# EAGLE board Zegar (EAGLE 5.06), part 1 of 2
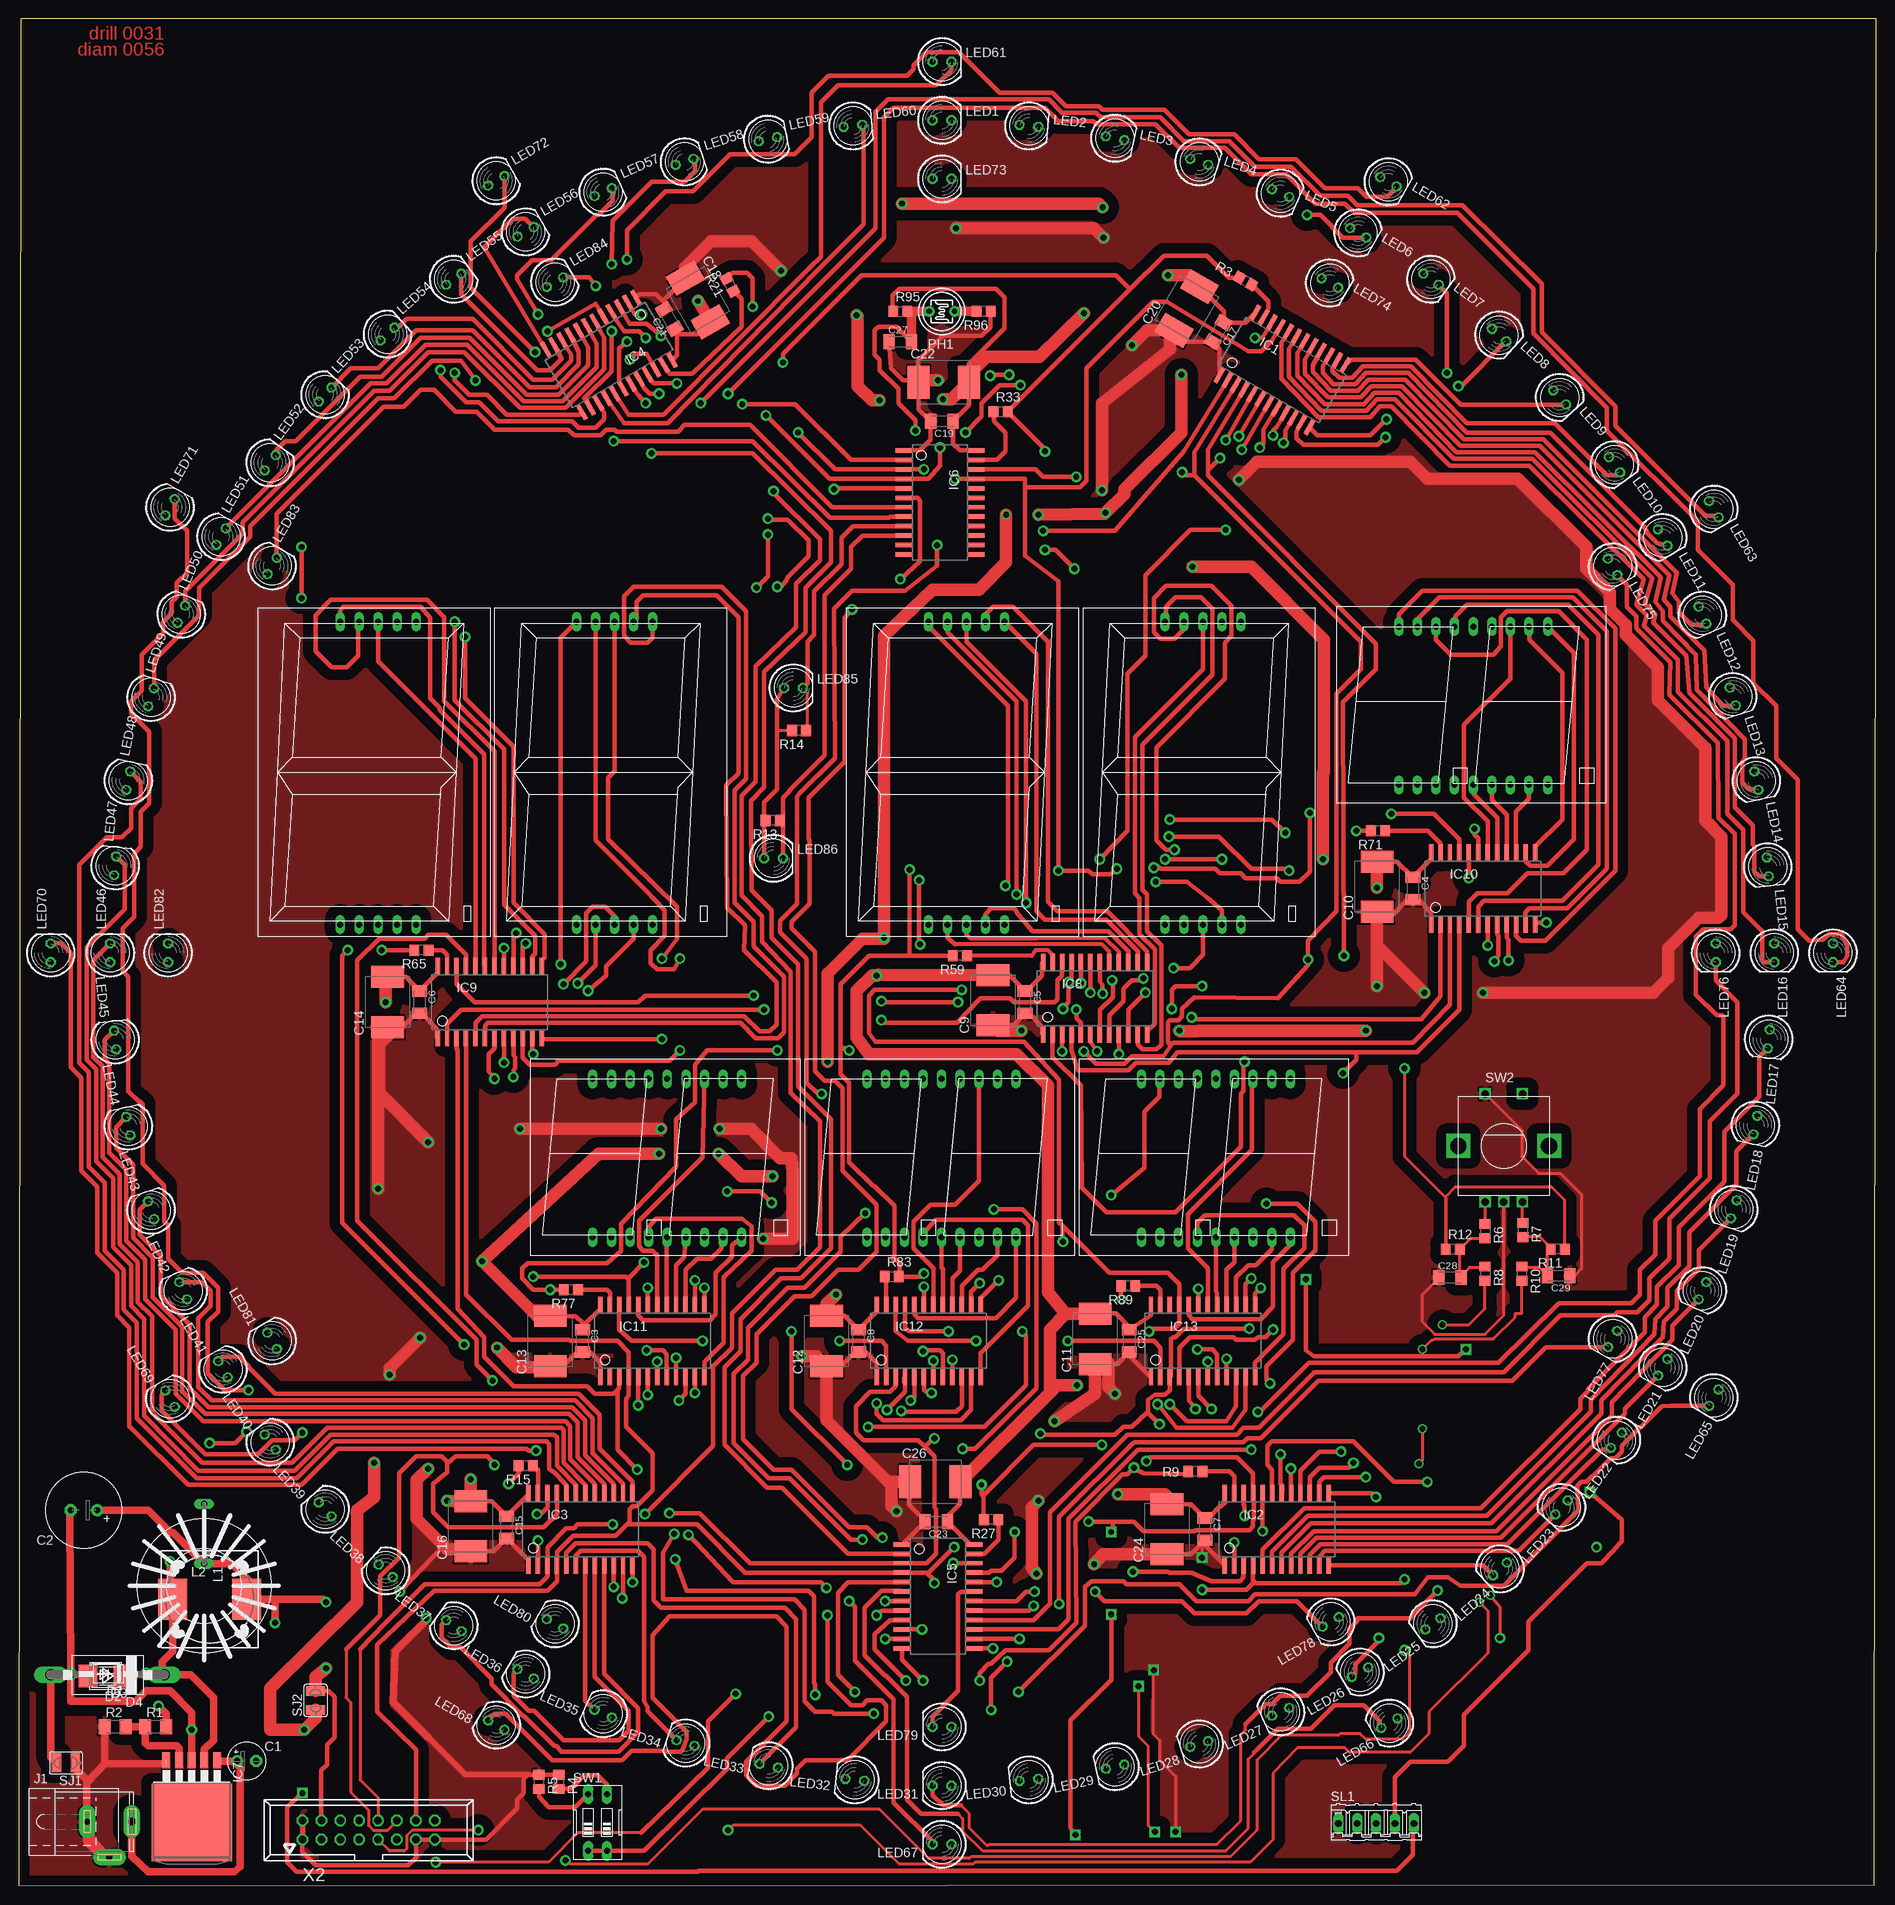
[diagram p2: board, top side]
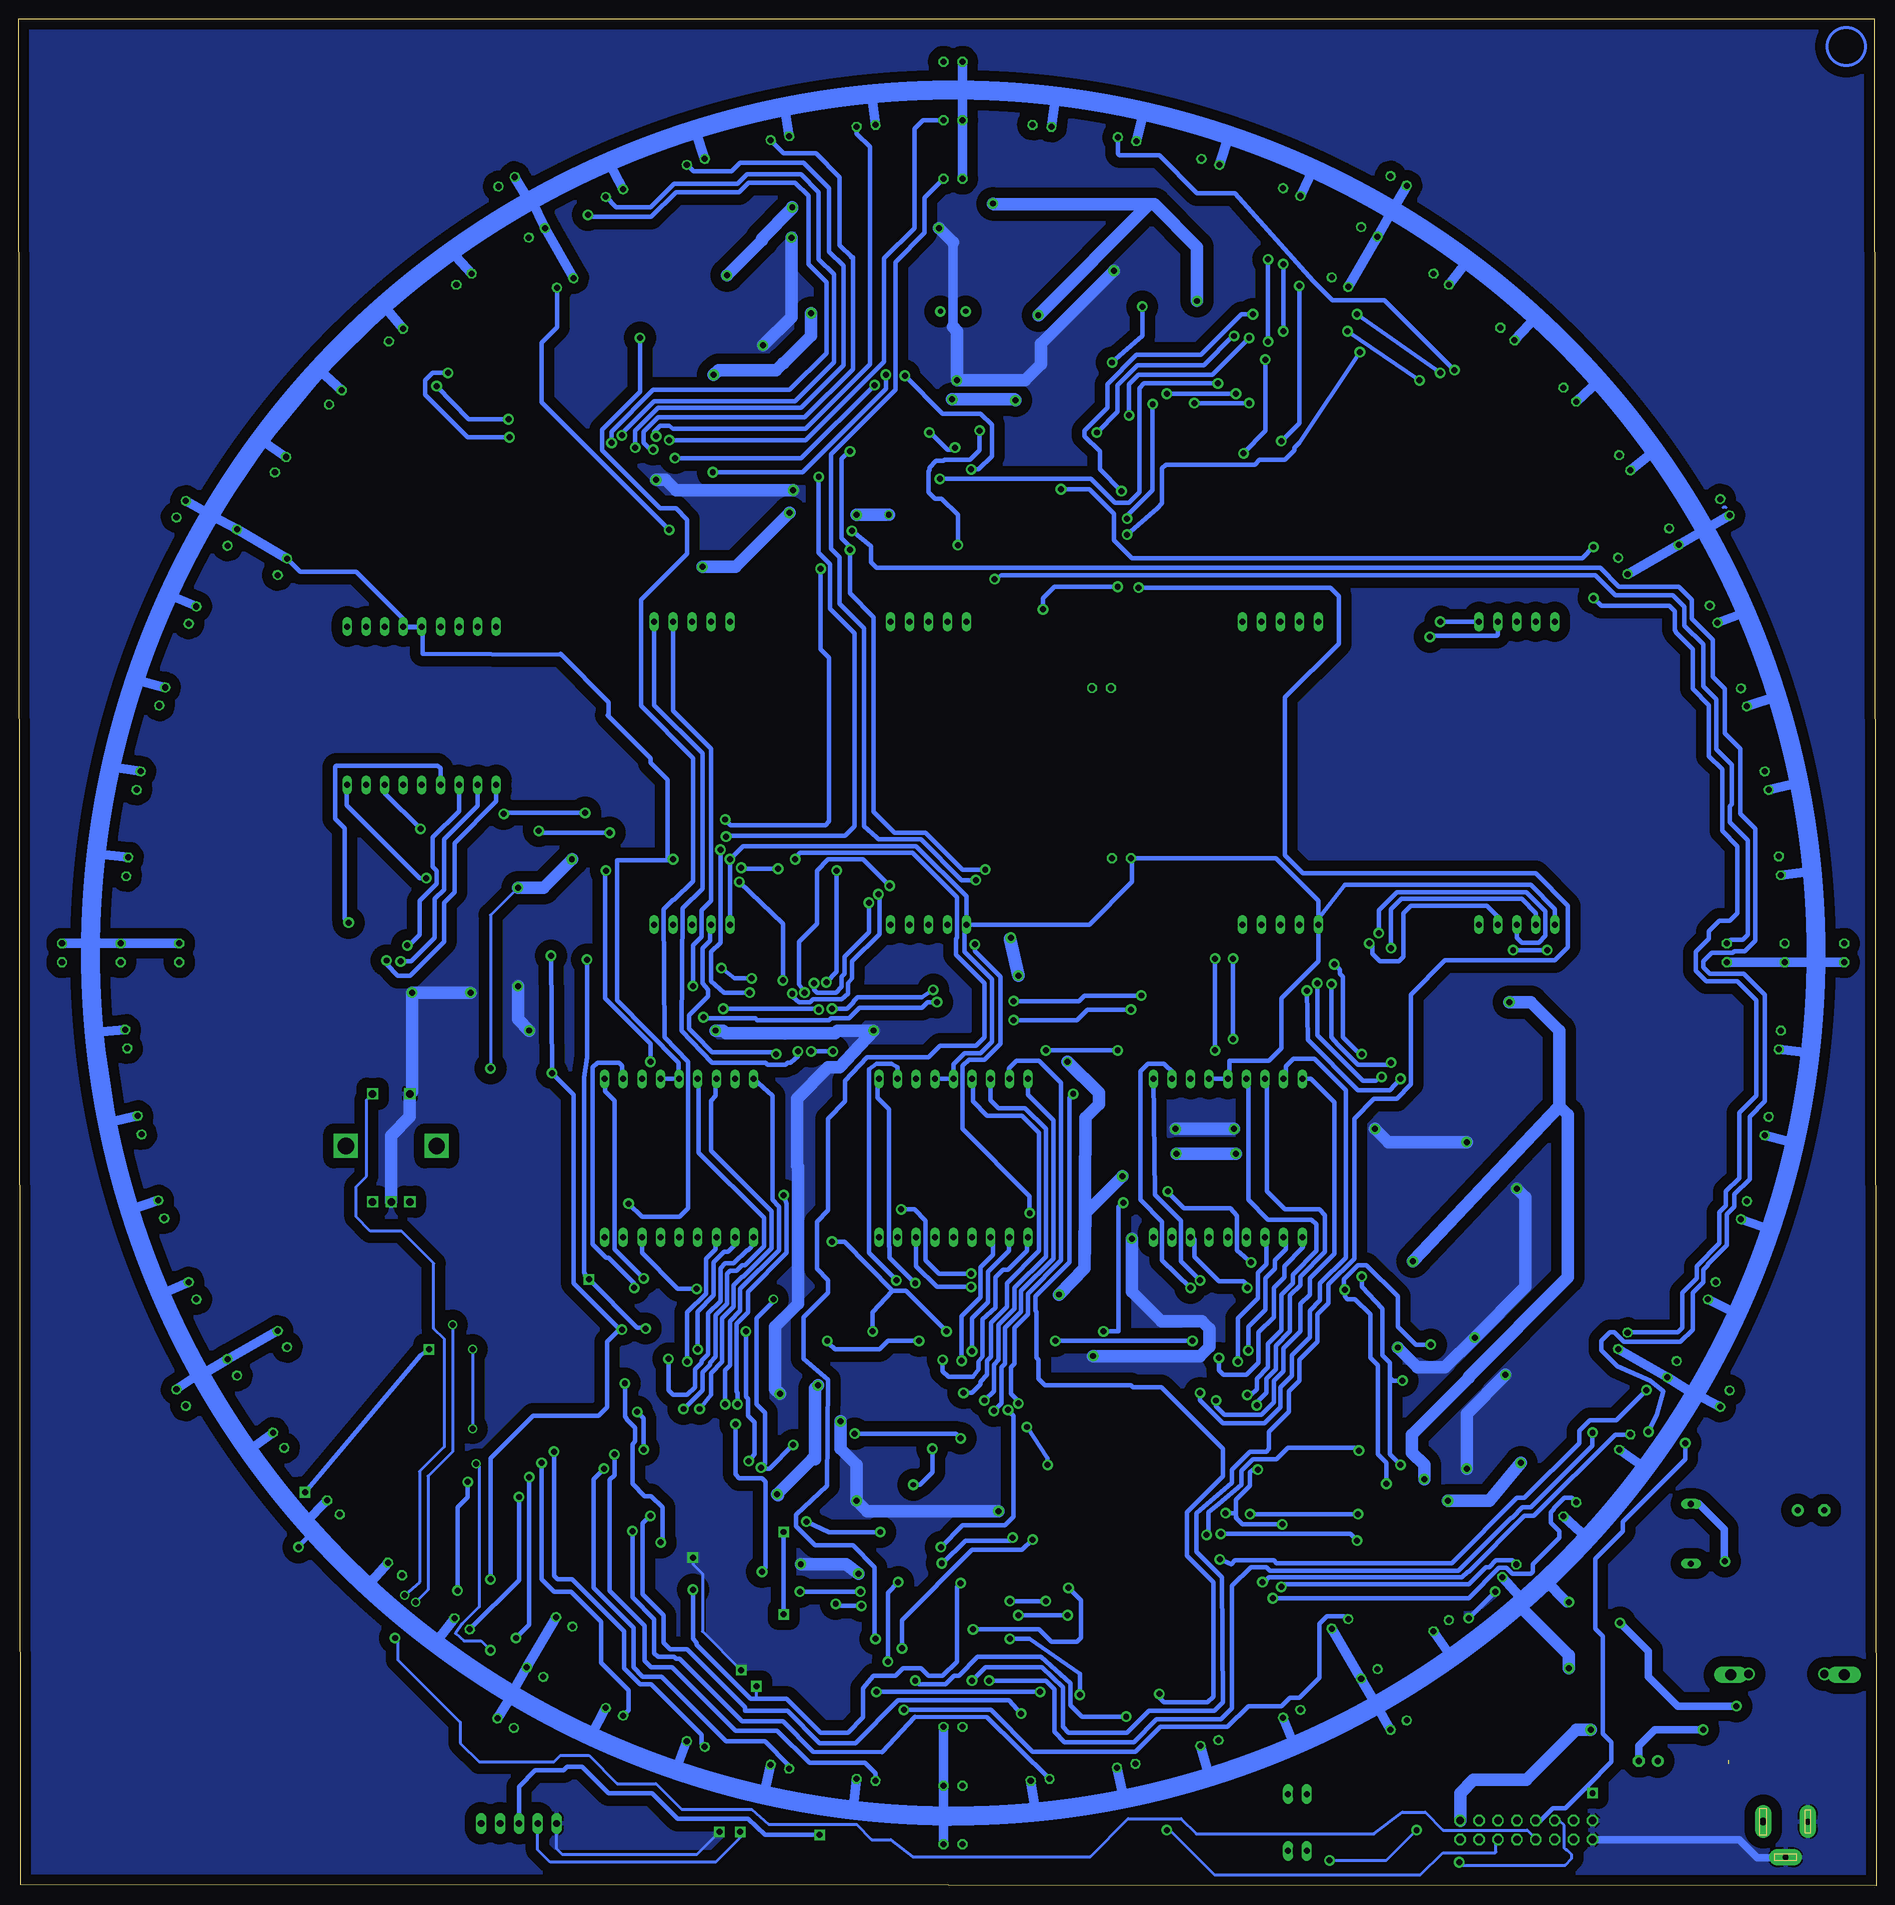
[diagram p3: board, bottom side, seen from below]

Size 249.41 x 250.62 mm. Coordinates in mm from the lower left corner, seen from the top.
Outline: 0,0 249.15,0.13 249.41,250.62 0.25,250.62 0,0
Copper layers (1*16): Top 0.035mm / dielectric 1.5mm / Bottom 0.035mm
Design rules "default": minimum track width 10mil, minimum drill 24mil, track to track 8mil, track to pad 8mil, pad to pad 8mil, via to via 8mil, smd to smd 8mil, copper to edge 40mil, drill to drill 8mil, minimum pad ring 10mil, minimum via ring 8mil, stop-mask expansion 4mil, vias tented up to drill 0mil, thermal gap 10mil

## Footprints (pad centres in the part's own frame; a part is rotated, then mirrored left to right if it is on the bottom)
E2,5-5 = drill 0.813 pad 1.6 round: + -1.27,0 | drill 0.813 pad 1.6 octagon: - 1.27,0
E3,5-10 = drill 0.813 pad 1.6 round: + -1.778,0 | drill 0.813 pad 1.6 octagon: - 1.778,0
C1206K = smd 1.5 x 2: 1 -1.5,0; 2 1.5,0
E/7260-38W = smd 2.95 x 4.4: + 3.375,0; - -3.375,0
DO41-10 = drill 1.118 round: A 5.08,0; C -5.08,0
SMB = smd 2.159 x 2.743: 1 -2.311,-0.127; 2 2.108,-0.102
MELF-MLL41 = smd 2.5 x 3: A 2.625,0; C -2.625,0
C2673 = drill 1.499 long: A 7.62,0; C -7.62,0
DISPLEDMALYPODW = drill 0.8 long: 1A 13.75,25; 1B 16.25,25; 1C 13.75,3.75; 1D 11.25,3.75; 1DP 16.25,3.75; 1E 8.75,3.75; 1F 8.75,25; 1G 11.25,25; 2A 26.25,25; 2B 28.75,25; 2C 26.25,3.75; 2D 21.25,3.75; 2DP 28.75,3.75; 2E 18.75,3.75; 2F 23.75,25; 2G 23.75,3.75; AN1 18.75,25; AN2 21.25,25
DISPLEDDUZYPOL = drill 0.8 long: A 19.05,43.18; AN 11.43,2.54; AN1 21.59,2.54; B 21.59,43.18; C 19.05,2.54; D 16.51,2.54; DP 16.51,43.18; E 13.97,2.54; F 13.97,43.18; G 11.43,43.18
SSOP24 = smd 0.6 x 2.2: 1 -6.985,-4.854; 2 -5.715,-4.854; 3 -4.445,-4.854; 4 -3.175,-4.854; 5 -1.905,-4.854; 6 -0.635,-4.854; 7 0.635,-4.854; 8 1.905,-4.854; 9 3.175,-4.854; 10 4.445,-4.854; 11 5.715,-4.854; 12 6.985,-4.854; 13 6.985,4.854; 14 5.715,4.854; 15 4.445,4.854; 16 3.175,4.854; 17 1.905,4.854; 18 0.635,4.854; 19 -0.635,4.854; 20 -1.905,4.854; 21 -3.175,4.854; 22 -4.445,4.854; 23 -5.715,4.854; 24 -6.985,4.854
TO263-5 = smd 1.067 x 2.159: 1 -3.404,-5.791; 2 -1.702,-5.791; 3 0,-5.791; 4 1.702,-5.791; 5 3.404,-5.791 | smd 10.8 x 10.41: 6 0,2.54
SPC4077 = drill 0.8 pad 2.184 long: 1 -3,0; 2 0,-4.8 | drill 1 pad 2.184 long: 3 3,0
10-17 = drill 0.813 long: 1 -11,0; 2 -3,0
DR125 = smd 3.85 x 5.5: 1 -4.975,0; 2 4.975,0
LED5MM = drill 0.813 octagon: A -1.27,0; K 1.27,0
T0-46-A10XX = drill 0.7 pad 1.4 round: 1 -1.7,0; 2 1.7,0
M1206 = smd 1.6 x 2: 1 -1.4,0; 2 1.4,0
R0805 = smd 1.3 x 1.5: 1 -0.95,0; 2 0.95,0
SJW = smd 1.27 x 2.54: 1 -1.27,0; 2 1.27,0
05P = drill 0.914 long: 1 -5.08,0; 2 -2.54,0; 3 0,0; 4 2.54,0; 5 5.08,0
EDG-02 = drill 0.813 long: 1 -1.27,-3.81; 2 1.27,-3.81; 3 1.27,3.81; 4 -1.27,3.81
ALPS_EC12E_SW = drill 1 square: A -2.5,-7.5; B 2.5,-7.5; C 0,-7.5; D -2.5,7; E 2.5,7 | drill 2.2 square: GND1 -6.1,0; GND2 6.1,0
057-016-1 = drill 1 octagon: 1 -8.89,-1.27; 2 -8.89,1.27; 3 -6.35,-1.27; 4 -6.35,1.27; 5 -3.81,-1.27; 6 -3.81,1.27; 7 -1.27,-1.27; 8 -1.27,1.27; 9 1.27,-1.27; 10 1.27,1.27; 11 3.81,-1.27; 12 3.81,1.27; 13 6.35,-1.27; 14 6.35,1.27; 15 8.89,-1.27; 16 8.89,1.27

## Placement (x,y rotation side)
C1  470uF  [E2,5-5]  30.61,16.76 0 top
C2  220uF  [E3,5-10]  8.76,50.42 180 top
C3  [C1206K]  75.69,73.15 270 top
C4  [C1206K]  187.2,133.86 270 top
C5  [C1206K]  135.13,118.62 270 top
C6  [C1206K]  53.85,118.62 270 top
C7  [C1206K]  159.26,47.88 270 top
C8  [C1206K]  112.78,73.15 270 top
C9  [E/7260-38W]  130.81,118.87 90 top
C10  [E/7260-38W]  182.37,134.11 90 top
C11  [E/7260-38W]  144.53,73.41 90 top
C12  [E/7260-38W]  108.46,73.15 90 top
C13  [E/7260-38W]  71.37,73.15 90 top
C14  [E/7260-38W]  49.53,118.62 90 top
C15  [C1206K]  65.53,48.13 270 top
C16  [E/7260-38W]  60.71,48.26 90 top
C17  [C1206K]  161.04,208.53 240 top
C18  [E/7260-38W]  91.19,212.85 300 top
C19  [C1206K]  123.95,196.6 180 top
C20  [E/7260-38W]  156.84,211.71 60 top
C21  [C1206K]  87.38,210.31 120 top
C22  [E/7260-38W]  124.21,201.8 0 top
C23  [C1206K]  123.19,48.89 180 top
C24  [E/7260-38W]  154.18,47.88 90 top
C25  [C1206K]  149.1,73.15 270 top
C26  [E/7260-38W]  123.06,54.23 0 top
C27  10n  [C1206K]  118.36,207.26 0 top
C28  10nf  [C1206K]  192.15,81.66 0 top
C29  10nf  [C1206K]  206.76,81.92 180 top
D1  1N4942  [DO41-10]  12.06,28.45 180 top
D2  [SMB]  11.56,28.07 180 top
D3  [MELF-MLL41]  11.94,28.19 180 top
D4  [C2673]  11.94,28.32 180 top
DL_S1  DISPL_LED_MALY_PODW_JJ  [DISPLEDMALYPODW]  176.53,144.02 0 top
DL_S2  DISPL_LED_MALY_PODW_JJ  [DISPLEDMALYPODW]  68.33,83.31 0 top
DL_S3  DISPL_LED_MALY_PODW_JJ  [DISPLEDMALYPODW]  105.16,83.31 0 top
DL_S4  DISPL_LED_MALY_PODW_JJ  [DISPLEDMALYPODW]  141.99,83.31 0 top
DUZY_JJ1  DISP-LED-DUZY-POL_JJ  [DISPLEDDUZYPOL]  142.49,126.49 0 top
DUZY_JJ2  DISP-LED-DUZY-POL_JJ  [DISPLEDDUZYPOL]  110.74,126.49 0 top
DUZY_JJ3  DISP-LED-DUZY-POL_JJ  [DISPLEDDUZYPOL]  63.5,126.49 0 top
DUZY_JJ4  DISP-LED-DUZY-POL_JJ  [DISPLEDDUZYPOL]  31.75,126.49 0 top
IC1  SCT 2024  [SSOP24]  169.67,203.45 330 top
IC2  SCT 2024  [SSOP24]  168.91,47.88 0 top
IC3  SCT 2024  [SSOP24]  75.44,47.88 0 top
IC4  SCT 2024  [SSOP24]  79.25,205.49 210 top
IC5  SCT 2024  [SSOP24]  123.44,38.86 270 top
IC6  SCT 2024  [SSOP24]  123.7,185.67 270 top
IC7  LM2576S lub 2596  [TO263-5]  23.24,11.05 180 top
IC8  SCT 2024  [SSOP24]  144.53,119.13 0 top
IC9  SCT 2024  [SSOP24]  63.25,118.62 0 top
IC10  SCT 2024  [SSOP24]  196.6,133.86 0 top
IC11  SCT 2024  [SSOP24]  85.09,73.15 0 top
IC12  SCT 2024  [SSOP24]  122.17,73.15 0 top
IC13  SCT 2024  [SSOP24]  159,73.15 0 top
J1  [SPC4077]  12.19,8.64 0 top
L1  [10-17]  24.89,40.26 270 top
L2  DR125  [DR125]  25.65,38.48 0 top
LED1  [LED5MM]  123.95,236.98 0 top
LED2  [LED5MM]  135.64,236.22 354 top
LED3  [LED5MM]  147.19,234.57 348 top
LED4  [LED5MM]  158.5,231.39 342 top
LED5  [LED5MM]  169.42,227.2 336 top
LED6  [LED5MM]  179.83,221.87 330 top
LED7  [LED5MM]  189.61,215.65 324 top
LED8  [LED5MM]  198.75,208.15 318 top
LED9  [LED5MM]  206.88,199.77 312 top
LED10  [LED5MM]  214.25,190.75 306 top
LED11  [LED5MM]  220.73,180.97 300 top
LED12  [LED5MM]  226.06,170.56 294 top
LED13  [LED5MM]  230.12,159.64 288 top
LED14  [LED5MM]  233.3,148.34 282 top
LED15  [LED5MM]  234.82,136.78 276 top
LED16  [LED5MM]  235.71,125.22 270 top
LED17  [LED5MM]  234.95,113.67 264 top
LED18  [LED5MM]  233.17,102.11 258 top
LED19  [LED5MM]  230.25,90.81 252 top
LED20  [LED5MM]  226.06,79.88 246 top
LED21  [LED5MM]  220.73,69.6 240 top
LED22  [LED5MM]  214.5,59.82 234 top
LED23  [LED5MM]  207.14,50.8 228 top
LED24  [LED5MM]  198.88,42.54 222 top
LED25  [LED5MM]  189.86,35.18 216 top
LED26  [LED5MM]  180.09,28.7 210 top
LED27  [LED5MM]  169.42,23.37 204 top
LED28  [LED5MM]  158.5,19.05 198 top
LED29  [LED5MM]  147.19,16 192 top
LED30  [LED5MM]  135.64,14.22 186 top
LED31  [LED5MM]  123.95,13.46 180 top
LED32  [LED5MM]  112.27,14.22 174 top
LED33  [LED5MM]  100.71,16.13 168 top
LED34  [LED5MM]  89.54,19.18 162 top
LED35  [LED5MM]  78.49,23.11 156 top
LED36  [LED5MM]  68.07,28.45 150 top
LED37  [LED5MM]  58.42,34.92 144 top
LED38  [LED5MM]  49.28,42.29 138 top
LED39  [LED5MM]  41.15,50.55 132 top
LED40  [LED5MM]  33.78,59.56 126 top
LED41  [LED5MM]  27.43,69.34 120 top
LED42  [LED5MM]  22.1,79.88 114 top
LED43  [LED5MM]  17.78,90.68 108 top
LED44  [LED5MM]  14.73,101.98 102 top
LED45  [LED5MM]  12.95,113.54 96 top
LED46  [LED5MM]  12.32,125.22 90 top
LED47  [LED5MM]  12.95,136.91 84 top
LED48  [LED5MM]  14.73,148.34 78 top
LED49  [LED5MM]  17.78,159.51 72 top
LED50  [LED5MM]  21.84,170.69 66 top
LED51  [LED5MM]  27.18,181.1 60 top
LED52  [LED5MM]  33.78,191.01 54 top
LED53  [LED5MM]  41.15,200.15 48 top
LED54  [LED5MM]  49.53,208.28 42 top
LED55  [LED5MM]  58.42,215.65 36 top
LED56  [LED5MM]  68.07,222 30 top
LED57  [LED5MM]  78.49,227.33 24 top
LED58  [LED5MM]  89.41,231.39 18 top
LED59  [LED5MM]  100.58,234.44 12 top
LED60  [LED5MM]  112.01,236.22 6 top
LED61  [LED5MM]  123.95,244.86 0 top
LED62  [LED5MM]  183.9,228.73 330 top
LED63  [LED5MM]  227.58,184.78 300 top
LED64  [LED5MM]  243.59,125.22 270 top
LED65  [LED5MM]  227.58,65.53 240 top
LED66  [LED5MM]  184.02,21.84 210 top
LED67  [LED5MM]  123.95,5.59 180 top
LED68  [LED5MM]  64.14,21.59 150 top
LED69  [LED5MM]  20.32,65.41 120 top
LED70  [LED5MM]  4.32,125.22 90 top
LED71  [LED5MM]  20.32,185.04 60 top
LED72  [LED5MM]  64.14,228.85 30 top
LED73  [LED5MM]  123.95,229.11 0 top
LED74  [LED5MM]  176.02,215.14 330 top
LED75  [LED5MM]  214,177.04 300 top
LED76  [LED5MM]  227.84,125.22 270 top
LED77  [LED5MM]  214,73.41 240 top
LED78  [LED5MM]  176.15,35.43 210 top
LED79  [LED5MM]  123.95,21.34 180 top
LED80  [LED5MM]  72.01,35.18 150 top
LED81  [LED5MM]  34.04,73.15 120 top
LED82  [LED5MM]  20.07,125.22 90 top
LED83  [LED5MM]  34.04,177.16 60 top
LED84  [LED5MM]  72.01,215.26 30 top
LED85  [LED5MM]  104.01,160.78 0 top
LED86  [LED5MM]  101.35,137.92 0 top
PH1  A1050_11  [T0-46-A10XX]  123.95,211.33 0 top
R1  [M1206]  18.42,21.34 0 top
R2  [M1206]  12.95,21.34 0 top
R3  1k  [R0805]  164.72,215.39 150 top
R4  [R0805]  72.52,13.97 270 top
R5  [R0805]  69.85,13.97 270 top
R6  200ohm  [R0805]  196.85,87.88 270 top
R7  200ohm  [R0805]  201.93,88.01 270 top
R8  200ohm  [R0805]  196.85,82.17 270 top
R9  1k  [R0805]  157.99,55.63 180 top
R10  200ohm  [R0805]  201.8,82.17 270 top
R11  10k  [R0805]  206.63,85.47 180 top
R12  10k  [R0805]  192.53,85.47 0 top
R13  na  [R0805]  101.22,143 180 top
R14  na  [R0805]  104.78,155.07 180 top
R15  1k  [R0805]  68.07,56.39 180 top
R21  1k  [R0805]  95.5,214.88 120 top
R27  1k  [R0805]  130.56,49.15 180 top
R33  1k  [R0805]  131.83,197.87 0 top
R59  1k  [R0805]  126.37,124.84 180 top
R65  1k  [R0805]  54.1,125.6 180 top
R71  1k  [R0805]  182.5,141.6 180 top
R77  1k  [R0805]  74.17,80.01 180 top
R83  1k  [R0805]  117.22,81.79 0 top
R89  1k  [R0805]  148.97,80.52 180 top
R95  10k  [R0805]  118.36,211.33 0 top
R96  10k  [R0805]  129.54,211.33 180 top
SJ1  [SJW]  6.35,16.51 180 top
SJ2  [SJW]  39.88,24.89 90 top
SL1  [05P]  182.25,8.38 0 top
SW1  [EDG-02]  77.72,8.51 0 top
SW2  EC12E_SW  [ALPS_EC12E_SW]  199.39,99.31 0 top
X2  057-016-1  [057-016-1]  46.99,7.49 0 top

## Tracks (layer width: path | path; a pad name or v marks a point on that pad's centre or on a via)
+5V  (via drill 0.8, 0.8 pad 1.42)
  Top 0.406: R11.1 207.52,85.53 207.52,92.08 205.74,93.85 192.91,93.85 191.58,92.52 R12.1 191.58,92.39 186.05,97.92 v186.05,109.73
  Top 0.61: C9.+ 133,122.25 C5.1 135.36,120.12 137.41,122.17 137.41,123.85 IC8.24 | C10.+ 185.07,137.49 C4.1 189.61,137.77 IC10.24 | C14.+ 51.97,121.99 C6.1 56.26,122.53 IC9.24 | IC4.24 88.39,205.44 88.39,208.28 | 88.39,208.28 88.13,208.55 C21.1 | C18.+ 91.22,208.28 88.39,208.28 | R95.1 117.35,211.39 117.35,213.49 118.24,214.38 131.19,214.38 132.33,213.23 132.33,209.04 127.58,204.29 127.58,202.82 C22.+ 127.58,198.72 C19.1 125.45,193.57 126.37,192.66 IC6.24 | C20.+ 161.79,211.38 C17.1 164.73,209.83 IC1.24 | C13.+ 71.45,76.45 74.8,76.45 75.69,75.57 C3.1 76.07,75.03 76.07,75.44 78.11,77.47 IC11.24 | C12.+ 110.9,76.53 C8.1 115.19,77.07 IC12.24 | IC13.24 152.02,76.58 150.75,75.69 149.25,74.8 C25.1 149.1,75.06 147.32,76.84 144.58,76.84 C11.+ | IC2.24 161.92,51.43 161.42,50.93 161.29,50.93 159.74,49.38 C7.1 157.38,51.25 C24.+ 154.18,52.27 | C26.+ 126.37,54.16 126.37,51.31 124.69,49.63 C23.1 127.74,45.85 IC5.24 | C16.+ 63.53,51.63 C15.1 68.45,52.55 IC3.24 | 145.8,184.15 v145.92,184.28
  Top 1.676: 138.43,66.22 C26.+ | 138.43,66.22 138.43,74.68 140.53,76.78 | 140.53,76.78 C11.+ | 140.53,76.78 138.18,79.65 138.18,107.44 133.98,111.63 114.17,111.63 112.52,113.92 112.52,120.14 114.63,122.25 115.12,122.25 v115.19,122.17 115.26,122.25 115.39,122.25 115.44,122.3 C9.+ | C13.+ 69.52,76.53 v62.23,83.82 77.85,98.3 v85.98,98.3 | v49.28,118.62 49.28,121.74 C14.+ | 154.18,52.27 153.87,52.58 v147.57,52.58 | C20.+ 157.01,216.15 v154.3,216.15 | v145.54,225.3 145.03,225.81 v118.62,225.81 | v91.19,212.72 C18.+ | v112.52,210.82 112.65,210.69 112.65,201.29 114.55,199.39 v115.57,199.39 | C22.+ 125.73,200.02 125.22,199.52 v124.08,199.52 | 138.43,66.22 139.39,67.18 v142.11,67.18 | v143,211.07 137.03,205.23 129.99,205.23 127.58,202.82 | v156.08,202.82 156.08,195.07 148.46,187.45 148.46,186.82 v145.92,184.28 | v157.61,177.04 165.48,177.04 175.26,167.26 175.26,149.48 175.13,149.35 v175.13,137.79 | v182.37,133.98 C10.+ | v132.59,184.02 132.59,177.67 128.91,173.99 122.68,173.99 116.2,167.77 v116.2,127.25 116.2,127.13 113.28,127.13 108.59,122.43 v108.59,110.62 | v136.91,184.02 145.8,184.15 | C12.+ 108.46,78.11 v109.73,79.38 | v101.22,95.25 97.03,95.25 v93.98,98.3 | v60.71,54.61 C16.+ 58.47,51.63 v57.53,51.69 | v47.75,56.77 47.75,52.2 45.47,50.42 45.47,38.1 33.78,26.54 33.78,20.96 v38.35,20.96 39.88,22.48 SJ2.1
  Bottom 0.406: v186.05,109.73 186.05,130.3 v182.37,133.98
  Bottom 0.61: 116.33,127.13 v116.2,127.25
  Bottom 1.676: v62.23,83.82 42.54,104.65 | 42.54,104.65 42.54,114.81 46.35,118.62 v49.28,118.62 | 147.45,52.45 v147.57,52.58 142.88,57.28 142.49,57.28 142.49,66.8 v142.11,67.18 | v154.3,216.15 149.61,220.85 149.61,221.11 145.54,225.17 v145.54,225.3 | v118.62,225.81 118.49,225.68 97.16,225.68 | 97.16,225.68 96.9,225.68 91.19,219.96 v91.19,212.72 | v115.57,199.39 115.7,199.52 v124.08,199.52 | v112.52,210.82 97.66,225.68 97.16,225.68 | v143,211.07 143,208.03 146.69,204.34 146.81,204.34 147.7,203.45 155.45,203.45 v156.08,202.82 | v145.92,184.28 153.16,177.04 v157.61,177.04 | v175.13,137.79 178.94,133.98 v182.37,133.98 | v115.19,122.17 116.33,127.13 | v132.59,184.02 v136.91,184.02 | 106.3,82.93 v109.73,79.38 | 106.3,82.93 106.17,103.12 104.39,104.9 104.39,106.43 v108.59,110.62 | 106.3,82.93 106.17,90.3 v101.22,95.25 | v93.98,98.3 v85.98,98.3 | v60.71,54.61 60.71,56.52 62.36,58.17 62.36,60.58 54.74,68.2 54.74,68.33 41.4,81.66 41.4,103.51 42.54,104.65 | v57.53,51.69 51.94,51.69 v47.75,56.77 | v38.35,20.96 40.26,20.96 46.99,14.22 54.1,14.22 55.88,12.45 X2.16
ADC_L  (via drill 0.8 pad 1.42)
  Top 0.406: 83.57,7.11 75.06,7.11 71.12,3.17 v56.01,3.17
  Top 0.61: C27.2 117.83,209.3 115.44,209.3 114.94,208.79 114.94,205.49 115.57,204.85 115.57,203.45 118.11,200.91 118.11,199.01 120.4,196.72 v120.4,195.33 | 123.19,180.09 v123.32,179.96 123.32,177.16 119,173.86 111.89,173.86 109.47,171.45 109.6,151.38 104.78,146.56 104.52,146.18 104.52,131.83 102.23,129.54 102.23,128.02 105.79,124.46 105.79,107.82 107.32,106.3 v107.82,106.3 | v96.27,25.78 92.58,22.1 92.58,15.88 83.57,7.11
  Top 1.27: 119.89,211.33 R95.2 | 119.89,211.33 PH1.1 | C27.2 119.89,208.53 119.89,211.33
  Bottom 0.406: v56.01,3.17 55.75,2.79 41.78,2.79 40.89,3.68 40.89,4.19 41.53,4.83 41.66,4.83 41.91,5.08 41.91,8.13 42.54,8.76 X2.6
  Bottom 0.61: v120.4,195.33 120.4,192.66 121.67,191.39 125.09,191.39 125.22,191.26 126.24,191.26 127.13,190.37 127.13,189.99 127.25,189.86 127.25,187.07 126.37,186.18 125.48,186.18 123.32,184.02 v123.32,179.96 | v107.82,106.3 108.33,105.79 108.33,83.69 112.9,79.12 112.9,77.22 112.78,77.09 112.78,70.87 112.52,70.61 112.52,68.07 111.63,67.18 100.08,67.18 99.82,66.93 96.01,66.93 87.76,58.67 87.76,54.99 92.58,50.16 92.58,44.32 89.03,40.77 89.03,25.4 89.79,24.64 95.63,24.64 96.27,25.27 v96.27,25.78
B$2
  Top 0.61: IC4.17 81.92,197.48 86.61,197.48 106.3,217.3 107.7,218.69 107.7,230.63 | 107.7,230.63 107.7,230.25 | 107.7,230.63 107.7,239.39 109.98,241.68 123.19,241.68 125.22,243.71 LED61.K
B$3  (via drill 0.8 pad 1.42)
  Top 0.61: IC4.18 80.65,201.8 80.65,206.38 v81.66,207.26 | v81.66,218.31 81.66,222.25 86.87,227.46 90.55,227.46 95.5,232.41 104.14,232.41 106.43,234.7 106.43,240.66 108.71,242.95 119.25,242.95 120.14,243.84 120.14,244.35 121.92,246.13 126.24,246.13 131.7,240.66 138.81,240.66 140.59,238.89 145.03,238.89 145.54,238.38 153.8,238.38 157.1,235.08 163.19,235.08 166.5,231.77 171.45,231.77 175.39,227.84 179.83,227.84 180.97,226.69 183.77,226.69 185,227.92 LED62.K
  Bottom 0.61: v81.66,207.26 v81.66,218.31
B$4  (via drill 0.8 pad 1.42)
  Top 0.61: LED63.K 228.01,183.9 226.44,183.9 214.38,195.96 214.38,198.63 204.47,208.53 204.47,215.01 193.8,225.55 179.7,225.55 178.44,226.82 174.75,226.82 170.81,230.76 165.99,230.76 162.56,234.19 156.46,234.19 153.29,237.36 145.29,237.36 144.65,238 140.08,238 138.3,239.78 116.71,239.78 115.06,238.12 115.06,222.5 v91.57,199.01 | v84.2,199.01 83.19,200.15 82.93,200.41 IC4.19
  Bottom 0.61: v84.2,199.01 v91.57,199.01
B$5  (via drill 0.8 pad 1.42)
  Top 0.61: IC4.20 83.95,201.04 84.71,200.28 v85.98,200.28 | v95.25,200.28 116.2,221.23 116.2,237.36 117.48,238.63 137.79,238.63 139.57,236.85 144.27,236.85 144.65,236.47 152.65,236.47 155.83,233.3 161.92,233.3 165.48,229.74 170.18,229.74 174.12,225.81 178.05,225.81 179.32,224.54 193.17,224.54 203.33,214.38 203.33,208.41 213.23,198.37 213.23,195.33 225.42,183.13 225.42,179.32 230.12,174.62 230.12,169.93 232.92,167.13 232.92,161.42 235.97,158.37 235.97,151.38 238.89,148.46 238.89,128.4 240.41,126.87 242.19,127 243.08,127.76 244.73,127.76 245.49,126.24 245.49,124.84 244.98,123.95 LED64.K 243.46,123.95
  Bottom 0.61: v85.98,200.28 v95.25,200.28
CLK  (via drill 0.8 pad 1.42)
  Top 0.406: X2.10 48.26,11.81 45.85,14.22 45.85,31.75
  Top 0.61: IC4.3 82.04,209.68 84.33,209.68 v86.23,208.03 | v104.65,195.07 109.6,190.12 IC6.3 v121.54,190.12 | IC10.3 192.15,118.24 187.2,113.16 154.94,113.16 154.62,112.71 | 154.62,112.71 153.67,111.38 149.48,111.38 148.46,110.36 144.65,110.36 v143,112.01 | v140.08,112.01 IC8.3 | IC1.3 157.86,192.41 157.86,189.36 | 157.86,189.36 180.21,167 180.21,163.32 176.91,160.02 176.91,130.81 173.1,126.87 v173.1,124.33 173.1,123.57 169.04,119.13 157.86,119.25 156.21,117.73 156.21,116.71 155.7,116.2 154.56,116.2 154.3,115.95 154.3,113.41 154.62,112.71 | v79.76,48.51 75.06,48.51 74.55,48.01 73.53,48.01 70.99,45.47 IC3.3 70.99,41.53 69.98,40.51 54.48,40.51 49.15,35.18 45.85,31.75 | v83.06,55.88 80.39,58.55 80.39,66.55 80.65,66.8 | v87.38,50.04 91.44,50.04 98.17,43.31 IC5.3 121.92,43.31 123.19,44.58 123.19,50.55 122.94,50.8 122.94,57.66 121.67,58.93 | 157.86,189.36 156.59,189.36 v156.21,189.74 | v132.97,202.82 130.56,202.82 v130.43,202.69 | 80.65,66.8 IC11.3 | 80.65,66.8 79.88,66.04 77.34,66.04 76.33,67.06 66.42,67.06 62.48,70.99 62.48,73.66 58.93,77.47 58.93,112.14 58.8,112.27 IC9.3 | IC12.3 117.73,67.06 116.97,66.29 114.3,66.29 | 114.3,66.29 112.4,64.39 112.4,60.83 113.41,59.82 120.78,59.82 121.67,58.93 | 114.3,66.29 113.67,65.66 | 151.64,63.63 151.64,65.28 152.53,65.91 153.92,65.91 154.56,66.55 IC13.3 154.69,68.43 154.69,73.41 154.94,73.66 155.32,73.66 156.46,74.8 v165.23,74.8 | 151.64,63.63 149.48,61.59 148.34,61.59 147.19,60.58 137.16,60.58 v137.16,60.71 | v122.94,60.07 122.81,60.07 121.67,58.93 | IC2.3 164.47,41.4 163.96,40.89 160.15,40.89 157.48,42.04 154.43,42.04 154.3,42.16 v149.61,42.16
  Top 0.61: v153.16,61.98 151.76,63.37 151.64,63.63 | SL1.4 184.78,14.61 186.82,16.64 191.9,16.64 194.06,18.8 194.06,22.99 202.69,31.62 202.69,35.43 210.57,43.31 212.47,43.31 214.25,45.09 214.25,45.21 215.26,46.23 215.26,49.15 212.72,51.31 v210.95,52.83 | v194.31,72.01 193.29,71.12 173.86,71.12 172.85,71.88 v172.85,81.41
  Bottom 0.61: v86.23,208.03 86.36,208.03 90.3,204.09 99.19,204.09 101.85,201.42 101.85,197.87 v104.65,195.07 | v143,112.01 v140.08,112.01 | v79.76,48.51 85.09,48.51 85.92,49.34 | 85.92,49.34 85.98,49.4 85.98,50.04 | 85.98,50.04 85.98,51.82 84.07,53.72 84.07,55.5 83.69,55.88 v83.06,55.88 | v87.38,50.04 85.98,50.04 | 85.98,50.04 85.92,49.34 | v156.21,189.74 144.14,189.74 132.97,200.91 v132.97,202.82 | v130.43,202.69 125.35,197.61 120.27,197.61 118.75,196.09 118.75,191.9 120.52,190.12 v121.54,190.12 | v137.16,60.71 123.57,60.71 v122.94,60.07 | v149.61,42.16 149.1,42.67 149.1,54.23 149.61,54.74 152.65,54.74 153.16,55.24 v153.16,61.98 | v165.23,74.8 165.35,74.93 166.37,74.93 v172.85,81.41 173.35,81.92 173.35,82.17 173.48,82.3 173.48,108.46 173.1,111.25 v173.1,124.33 | v210.95,52.83 195.45,71.25 v194.31,72.01
ENCA  (via drill 0.8, 0.8 pad 1.42)
  Top 0.406: v188.47,72.01 189.74,73.28 189.99,73.28 190.12,73.41 197.99,73.41 200.91,76.33 200.91,76.84 201.8,76.84 R10.2 | v188.47,61.34 188.47,57.15 v187.96,56.64 | v186.05,31.62 186.69,30.99 186.69,20.57 185.8,19.69 180.85,19.69 180.09,20.45 177.42,20.45 177.16,20.19 169.54,20.19 166.24,16.89 166.24,7.49 162.69,3.94 127.89,3.94 127.64,3.68 122.17,3.68 115.57,10.29 91.82,10.29 84.45,2.92 74.04,2.92 v73.41,3.43 | X2.9 49.78,4.7 51.82,4.7 52.07,4.95 52.07,6.73 52.83,7.49 v61.72,7.49
  Bottom 0.406: v188.47,72.01 v188.47,61.34 | v187.96,56.64 187.58,56.26 187.58,37.46 189.86,35.18 190.75,33.91 189.61,32.89 187.32,32.89 v186.05,31.62 | v61.72,7.49 65.79,3.43 72.9,3.43 | 72.9,3.43 73.03,3.43 | v73.41,3.43 72.9,3.43
ENCB  (via drill 0.8, 0.8 pad 1.42)
  Top 0.406: v196.09,38.1 197.23,36.96 197.23,31.24 189.36,23.37 189.36,20.45 186.82,17.91 178.69,17.91 178.05,18.54 171.7,18.54 168.4,15.11 168.4,6.22 165.35,3.17 128.4,3.17 128.14,2.92 118.24,2.92 113.03,8.13 95.89,8.13 v95.25,7.49 | v191.13,75.31 194.69,75.31 196.85,77.47 R8.2
  Bottom 0.406: v191.13,75.31 191.13,58.29 194.44,54.99 194.44,39.75 v196.09,38.1 | v95.25,7.49 94.87,7.49 88.9,1.52 61.21,1.52 58.17,4.45 51.18,4.45 51.05,4.57 51.05,5.97 X2.11
GND  (via drill 0.8 pad 1.42)  (1 unrouted)
  Top 0.406: IC4.1 82.44,213.61 | C29.1 208.91,81.92 209.8,82.8 209.8,92.84 207.01,95.63 204.09,95.63 201.8,97.92 201.8,101.4 SW2.D | C28.1 190.65,81.56 188.47,79.38 188.47,75.69 190.12,74.04 196.85,74.04 199.39,76.58 SW2.C | IC2.1 158.88,46.07 | 158.88,46.07 158.88,46.23 | 158.88,46.07 v158.88,44.07 | v152.4,28.96 152.27,28.83 152.27,20.45 153.16,19.56 153.16,16.89 155.32,14.73 v155.32,7.24
  Top 0.61: C9.- 133.76,115.62 C5.2 135.61,117.12 137.41,115.32 137.41,114.4 IC8.1 | C10.- 182.81,130.3 184.4,130.3 186.46,132.36 C4.2 187.22,132.33 187.96,132.33 189.61,130.68 IC10.1 | C14.- 51.49,115.24 53.34,117.09 53.82,117.09 C6.2 54.08,117.12 56.13,115.06 56.13,113.89 IC9.1 | IC11.1 78.11,70.23 76.71,71.63 75.72,71.63 C3.2 74.95,71.65 72.9,69.6 71.56,69.6 C13.- | IC4.1 83.3,213.61 85.6,213.61 86.63,212.59 C21.2 86.63,212.9 C18.- | C27.1 117.12,203.68 118.75,202.06 120.7,202.06 C22.- | R96.1 130.49,209.23 129.29,208.03 124.08,208.03 120.78,204.72 120.78,201.98 C22.- | C22.- 120.83,198.22 C19.2 122.45,194.08 121.03,192.66 IC6.1 | C20.- 156.71,207.23 C17.2 161.2,206.32 IC1.1 | C12.- 110.42,69.78 112.27,71.63 112.75,71.63 C8.2 113.77,71.65 115.19,70.23 IC12.1 | C11.- 147.48,70.03 C25.2 | C25.2 149.1,71.22 IC13.1 | C24.- 157.38,44.5 C7.2 159.26,45.69 IC2.1 | IC5.1 118.64,45.85 C23.2 121.69,49 119.51,51.18 119.51,54.05 C26.- | IC3.1 68.45,43.71 C15.2 63.78,44.88 C16.- 60.38,45.21 59.31,45.21 | C25.2 149.1,71.63 147.57,70.1 146.43,70.1 146.3,70.23 | v51.18,39.5 51.43,39.75 57.09,45.66 | 54.74,35.69 v54.74,35.94 | 37.85,6.1 38.23,6.48 38.23,8.89 X2.2 X2.1 38.1,4.57 39.88,2.79 52.32,2.79 53.34,3.81 X2.13 X2.15 62.74,6.22 66.93,10.41 66.93,11.56 67.82,12.45 67.82,14.35 68.39,14.92 R5.1 R4.1 | 54.99,19.94 55.12,19.94
  Top 0.813: 54.99,19.94 60.01,14.92 68.39,14.92
  Top 1.016: 13.08,16.38 11.56,16.38 9.33,14.03 | 13.08,16.38 19.81,16.38 | 9.33,14.03 9.14,13.84 9.14,8.68 J1.1 | SJ1.1 7.62,15.75 9.33,14.03 | R2.1 11.55,16.39 13.08,16.38 | 54.74,35.69 50.55,31.5 50.29,24.64 54.99,19.94
  Top 1.676: 117.22,54.23 C26.- | 117.22,54.23 116.71,54.23 108.46,62.48 C12.- 107.12,71.12 v105.16,71.12 | C11.- 144.53,66.04 v139.06,62.36 | C24.- 145.6,44.5 v144.4,43.18 | v136.65,41.91 136.02,42.67 136.02,50.8 v136.91,51.69 | C18.- 89.5,217.26 92.96,220.73 98.43,220.73 v102.36,216.79 | v123.44,202.06 120.96,202.06 C22.- | 154.56,208.79 151.51,208.79 v149.48,206.76 | 154.56,208.79 C20.- | v145.67,221.23 144.4,222.5 v125.86,222.5 | v117.86,50.29 117.22,50.93 117.22,54.23 | v145.41,187.32 145.41,199.01 154.56,206.25 154.56,208.79 | v163.83,188.72 166.24,191.13 186.82,191.13 189.1,188.85 201.29,188.85 210.44,179.7 210.44,176.78 213.61,173.61 213.61,171.45 215.77,169.29 215.77,167.89 220.09,163.58 220.09,159.13 226.44,152.78 226.44,143 228.6,140.84 228.6,130.3 228.22,129.92 225.55,129.92 221.49,125.86 221.49,121.92 219.46,119.89 v196.6,119.89 | v188.72,119.89 182.37,126.24 | 182.37,126.24 C10.- | 182.37,126.24 v182.37,120.78 | v180.85,114.81 158.37,114.81 158.24,114.68 155.96,114.68 v155.83,114.81 | v134.62,114.81 131.5,114.81 C9.- | 146.3,70.23 146.3,66.93 v147.19,66.04 | 71.56,69.6 66.8,69.6 v64.26,72.26 | v48.26,93.6 48.26,113.97 C14.- | 59.31,45.21 57.53,45.21 57.09,45.66 53.47,49.28 53.47,54.48 v54.99,56.01 | v49.78,68.58 49.78,69.47 v53.91,73.6 | 50.55,115.06 48.39,112.9 48.39,106.43 v54.99,99.82 | v86.23,101.6 v67.31,101.6 | v94.11,101.6 98.3,101.6 102.23,97.66 103.76,97.66 103.89,95.89 103.89,86.87 v99.95,86.87 | J1.2 11.66,3.84 9.4,6.1 9.4,8.43 J1.1
  Bottom 0.406: v158.88,44.07 158.88,43.18 157.61,41.91 157.61,34.16 v152.4,28.96 | v155.32,7.24 158.37,4.19 176.4,4.19 177.16,4.95 SL1.1
  Bottom 0.61: v196.6,119.89 197.1,119.89 | v54.74,35.94 v51.18,39.5
  Bottom 1.016: J1.2 12.22,3.81 16,3.81 18.42,6.22 X2.1
  Bottom 1.27: 123.95,220.6 123.95,209.3
  Bottom 1.676: v117.86,50.29 135.51,50.29 v136.91,51.69 136.91,56.52 139.06,58.67 v139.06,62.36 | v144.4,43.18 138.3,43.18 v136.65,41.91 | v102.36,216.79 112.14,207.01 112.14,204.22 114.3,202.06 v123.44,202.06 123.44,208.66 123.95,209.3 | v149.48,206.76 145.67,210.57 v145.67,221.23 | v125.86,222.5 123.95,220.6 | v145.41,187.32 161.16,187.32 162.56,188.72 v163.83,188.72 | v188.72,119.89 v196.6,119.89 196.6,106.61 SW2.D 196.89,103.21 199.39,100.71 SW2.C | v182.37,120.78 182.37,116.33 v180.85,114.81 | v155.83,114.81 154.81,114.81 154.43,114.43 139.83,114.43 139.45,114.81 v134.62,114.81 139.19,109.86 140.72,109.86 144.91,105.66 144.91,96.65 144.78,96.52 144.78,78.11 147.83,75.06 147.83,66.68 v147.19,66.04 | v64.26,72.26 61.59,69.6 57.91,69.6 v53.91,73.6 47.12,80.39 47.12,92.46 v48.26,93.6 | v54.99,56.01 54.99,63.37 v49.78,68.58 | v54.99,99.82 65.53,99.82 v67.31,101.6 | v94.11,101.6 v86.23,101.6 | v99.95,86.87 99.95,79.76 96.01,75.82 90.55,75.82 89.54,74.8 89.54,72.39 90.81,71.12 v105.16,71.12
  pour Bottom (isolate 1.422): -0.13,250.06 249.81,250.06 249.94,1.02 0.25,0.76 0,249.94
  pour Top (isolate 1.422): 0.38,250.57 249.55,250.57 249.3,1.02 0.25,0.89 0.25,249.81
LA  (via drill 0.8 pad 1.42)
  Top 0.406: v152.53,7.24 151.64,8.13 151.64,18.8 150.37,20.07 v150.37,26.8
  Top 0.61: IC4.4 80.26,210.06 81.28,208.66 83.31,208.66 v84.2,207.77 | v100.33,197.36 108.84,188.85 IC6.4 122.17,188.85 123.7,190.63 v123.7,193.04 | IC10.4 193.42,117.6 187.71,111.89 179.58,111.89 | 179.58,111.89 155.57,111.89 154.43,110.49 149.99,110.49 148.97,109.47 142.24,109.47 141.35,112.14 IC8.4 | IC1.4 159.64,192.79 159.64,189.36 | 159.64,189.36 182.25,166.75 182.25,163.32 177.8,158.88 v177.93,124.84 | v177.8,109.09 179.58,110.87 179.58,111.89 | 81.53,48.39 80.14,46.99 74.42,46.99 72.26,44.83 IC3.4 72.26,40.89 70.99,39.62 55.75,39.62 48.13,32.38 48.13,23.37 53.34,18.29 X2.14 | 81.53,48.39 82.04,48.89 82.04,50.55 82.42,50.93 82.93,50.93 85.09,53.09 85.09,58.04 81.53,61.59 81.53,65.41 81.92,65.79 IC11.4 81.92,71.63 80.39,73.15 74.04,73.15 73.91,73.28 66.17,73.28 60.07,79.38 IC9.4 | 81.53,48.39 81.66,48.51 91.06,48.51 97.54,42.04 IC5.4 121.92,42.04 | 159.64,189.36 159.64,189.99 v161.29,191.64 | v134.49,201.42 131.7,201.42 129.29,199.01 129.29,197.23 v127.13,195.07 | 121.92,42.04 122.17,42.04 v125.6,45.47 | v116.59,63.88 119,66.29 119,67.56 118.87,67.69 118.87,68.17 IC12.4 | v186.05,41.15 185.55,40.64 166.12,40.64 165.73,41.02 IC2.4 165.73,40.64 164.85,39.75 v158.88,39.75 | IC13.4 155.83,72.26 157.23,73.66 163.07,73.66 163.45,73.28 165.99,73.28 166.37,73.66 167.39,73.66 v168.4,74.68 | v122.94,40.64 122.94,41.02 121.92,42.04
  Bottom 0.406: SL1.2 179.7,4.83 178.05,3.17 155.83,3.17 152.53,6.48 v152.53,7.24 | 150.37,25.15 v150.37,26.8
  Bottom 0.61: v84.2,207.77 89.15,202.82 99.06,202.82 100.33,201.55 v100.33,197.36 | v177.93,124.84 v177.8,109.09 174.88,106.17 174.88,80.9 168.78,74.8 168.78,74.68 | v161.29,191.64 144.4,191.64 v134.49,201.42 | v127.13,195.07 127,195.07 124.71,192.79 123.95,192.79 v123.7,193.04 | v125.6,45.47 122.68,48.39 116.97,48.39 115.82,49.53 115.82,63.12 v116.59,63.88 | v186.05,41.15 186.05,57.4 180.34,63.12 171.58,63.12 170.43,64.26 170.43,73.03 168.78,74.68 | 168.78,74.68 v168.4,74.68 | v158.88,39.75 158.88,33.15 158.37,32.64 158.37,32.38 151.13,25.15 150.37,25.15 146.3,25.15 141.73,20.57 138.05,20.57 136.02,22.61 136.02,26.54 134.62,28.19 131.7,28.19 130.68,29.21 128.27,29.21 127.25,28.19 125.35,28.19 123.44,30.1 123.44,40.13 v122.94,40.64
LEV1  (via drill 0.7 pad 1.42, 0.8 pad 1.27, 0.8 pad 1.42)
  Top 0.61: 149.19,214.28 R33.2 137.79,192.85 v137.79,192.53 | 149.19,214.28 153.73,218.82 159.51,218.82 162.47,215.87 R3.2 | R21.2 95.86,216.53 97.79,216.53 98.55,215.77 v98.55,211.96 | v102.62,204.47 102.62,205.61 113.16,216.15 147.32,216.15 149.19,214.28 | R9.2 156.66,55.24 151,55.37 149.73,56.01 v149.73,56.13 148.84,55.24 148.21,55.24 141.86,48.89 141.99,35.31 138.3,31.62 132.46,31.62 130.56,29.85 130.17,29.85 129.03,28.58 v129.03,27.56 | v148.08,78.74 148.02,78.8 R89.2 | v119.63,136.4 119.63,124.84 | 119.63,124.84 R59.2 | v145.41,59.18 136.27,59.18 129.54,52.45 129.54,52.32 | 129.54,52.32 129.54,49.21 R27.2 | 119.63,124.84 114.17,124.84 110.36,121.03 110.36,112.65 | 110.36,112.65 110.36,108.97 111.51,107.82 111.51,97.16 114.68,93.98 114.81,93.98 117.6,91.31 117.6,84.45 117.35,84.2 117.6,84.2 118.24,83.57 118.24,81.85 R83.2 121.16,81.79 v121.54,82.17 | v130.94,90.81 134.75,90.81 136.65,88.9 136.65,66.8 128.4,58.67 v126.75,58.67 | v129.29,53.85 129.29,52.58 129.54,52.32 | v179.58,141.6 R71.2 | v170.05,141.35 168.27,143.13 v154.56,143.13 | v141.73,176.78 139.19,179.32 v137.79,179.32 | v48.77,125.6 R65.2 | v44.2,125.6 43.43,124.84 43.43,89.03 v59.82,72.64 | v71.37,80.01 R77.2 69.09,80.01 67.56,81.53 67.56,82.93 68.33,83.57 78.99,83.57 80.9,85.22 80.9,88.9 88.27,96.52 88.27,102.87 90.81,105.16 90.81,110.24 92.46,112.14 v101.85,112.14 | 110.36,112.65 v111.51,112.14 | R15.2 67.12,55.31 v65.79,53.97 | v100.71,22.73 95.12,17.14 95.12,15.75 83.95,4.7 SW1.2 SW1.1
  Bottom 0.61: v98.55,211.96 98.55,208.03 v102.62,204.47 | 149.22,56.64 v149.73,56.13 | 149.22,56.64 149.22,63.5 150.37,64.64 150.37,76.2 148.08,78.49 v148.08,78.74 | v137.79,192.53 138.43,192.02 138.94,191.52 138.94,180.85 137.79,179.7 v137.79,179.32 137.79,173.48 134.62,170.31 134.62,144.14 131.83,141.35 127.64,141.35 122.68,136.4 v119.63,136.4 | 149.22,56.64 149.86,56.01 148.59,56.01 v145.41,59.18 | v121.54,82.17 125.86,82.17 127.64,83.95 127.64,89.28 129.16,90.81 v130.94,90.81 | v126.75,58.67 126.75,55.5 128.4,53.85 v129.29,53.85 | v179.58,141.6 179.32,141.35 v170.05,141.35 | v154.56,143.13 153.8,142.37 141.1,142.37 140.59,142.88 140.59,164.85 141.73,165.99 v141.73,176.78 | v44.2,125.6 v48.77,125.6 | v59.82,72.64 61.85,72.64 64.26,75.06 64.26,79.12 68.45,83.31 69.6,83.31 71.5,81.41 71.5,80.14 v71.37,80.01 71.37,79.12 70.99,78.74 69.98,78.74 67.95,76.71 67.95,70.87 66.93,69.85 66.93,57.91 65.79,56.77 v65.79,53.97 | v111.51,112.14 v101.85,112.14 | v100.71,22.73 106.68,22.73 108.2,24.26 108.2,27.18 112.14,30.73 120.65,30.73 123.19,28.19 123.83,28.19 124.97,27.05 128.52,27.05 v129.03,27.56
N$1  (via drill 0.8 pad 1.42)
  Top 0.61: v162.05,194.06 IC1.5
  Bottom 0.61: v162.05,194.06 143.76,194.06 133.22,204.6 133.22,218.44 129.16,222.5 129.16,235.84 128.02,236.98 LED1.K
N$2  (via drill 0.8 pad 1.42)
  Top 0.61: v163.83,194.56 IC1.6
  Bottom 0.61: v163.83,194.56 164.08,195.2 163.32,195.96 162.05,195.96 161.54,195.58 143.76,195.58 135.13,204.22 135.13,218.57 135.13,233.43 136.9,235.2 LED2.K
N$3  (via drill 0.8 pad 1.42)
  Top 0.61: v164.21,192.79 IC1.7
  Bottom 0.61: 137.41,218.44 137.41,203.58 143.89,197.1 163.58,197.1 165.48,195.2 165.48,193.67 164.59,192.79 v164.21,192.79 | 137.54,218.57 139.19,220.22 139.19,229.36 142.37,232.54 146.69,232.54 148.44,234.29 LED3.K | 137.41,218.44 137.54,218.57 | 137.54,218.57 137.67,218.57 | 137.54,218.57 137.41,218.57 137.41,218.44
N$4  (via drill 0.8 pad 1.42)
  Top 0.61: v166.62,193.04 167.13,193.55 167.13,195.45 IC1.8
  Bottom 0.61: LED4.K 158.83,230.12 153.67,230.12 152.53,231.27 144.02,231.27 140.59,227.84 140.59,219.33 138.68,217.42 138.68,204.09 144.4,198.37 163.45,198.37 163.58,198.37 166.62,195.33 v166.62,193.04
N$5  (via drill 0.8 pad 1.42)
  Top 0.61: v168.4,194.69 168.4,195.33 168.91,195.83 IC1.9
  Bottom 0.61: LED5.K 170.55,226.69 169.16,225.3 164.59,225.3 161.42,228.47 152.91,228.47 151.64,229.74 144.4,229.74 141.99,227.33 141.99,218.31 139.95,216.28 139.95,204.47 145.16,199.26 163.83,199.26 164.08,199.26 168.4,194.94 v168.4,194.69
N$6  (via drill 0.8 pad 1.42)
  Top 0.61: LED6.K 177.8,221.23 174.75,224.28 v172.97,224.28 | v169.8,193.67 170.05,193.93 170.05,195.33 IC1.10
  Bottom 0.61: v172.97,224.28 172.72,224.03 164.47,224.03 161.16,227.33 152.65,227.33 151.38,228.6 145.16,228.6 143.38,226.82 143.38,217.68 140.97,215.26 140.97,205.74 145.92,200.79 164.21,200.79 169.8,195.2 v169.8,193.67
N$7  (via drill 0.8 pad 1.42)
  Top 0.61: LED7.K 191.77,213.77 v191.77,203.07 | v183.51,194.44 182.5,193.42 172.47,193.42 171.58,194.31 171.58,195.2 IC1.11
  Bottom 0.61: v191.77,203.07 193.8,203.07 194.82,202.06 194.82,200.15 189.1,194.44 v183.51,194.44
N$8  (via drill 0.8 pad 1.42)
  Top 0.61: LED8.K 193.69,201.29 v193.29,201.29 | v183.64,196.85 181.48,194.69 174.37,194.69 IC1.12
  Bottom 0.61: v193.29,201.29 188.98,196.85 v183.64,196.85
N$9
  Top 0.61: IC1.13 178.83,204.85 187.58,204.85 193.6,198.83 LED9.K
N$10
  Top 0.61: IC1.14 176.4,203.71 176.4,203.33 177.29,202.44 179.07,202.44 180.47,203.96 186.94,203.96 194.44,196.34 206.25,196.34 213.23,189.36 214.63,189.36 LED10.K
N$11
  Top 0.61: IC1.15 175.13,203.96 175.13,203.07 176.53,201.55 179.45,201.55 180.85,203.07 186.56,203.07 194.44,195.07 205.61,195.07 218.19,182.5 218.69,181.48 219.92,180.26 LED11.K
N$12
  Top 0.61: IC1.16 173.74,204.09 173.74,203.2 176.15,200.66 179.83,200.66 181.23,202.18 186.18,202.18 194.06,194.18 204.72,194.18 222.63,176.28 222,173.48 222.88,172.34 222.88,170.94 224.54,169.29 226.47,169.29 LED12.K
N$13
  Top 0.61: IC1.17 172.72,204.85 172.72,202.95 175.77,199.77 180.21,199.77 181.61,201.29 185.67,201.29 193.55,193.29 204.22,193.29 221.61,175.89 220.85,172.59 221.74,171.7 221.74,170.43 226.31,165.86 226.57,160.91 228.79,158.43 LED13.K
N$14
  Top 0.61: IC1.18 171.7,205.74 171.7,202.69 175.39,198.88 180.59,198.88 181.99,200.41 185.29,200.41 193.04,192.41 203.58,192.41 220.47,175.64 219.71,172.34 220.73,171.07 220.73,169.8 225.17,165.23 225.3,160.53 231.77,153.92 231.77,151.26 231.39,150.88 231.39,148.08 232.28,147.19 233.46,147.19 LED14.K
N$15
  Top 0.61: IC1.19 170.56,206.25 170.56,202.56 174.88,197.99 180.97,197.99 182.37,199.52 184.78,199.52 192.66,191.52 203.2,191.52 219.33,175.51 218.31,172.08 219.71,170.69 219.46,169.54 223.9,165.1 224.28,160.15 230.38,154.05 230.38,144.78 232.79,142.37 232.79,139.83 233.04,139.57 233.04,136.14 233.67,135.52 LED15.K
N$16
  Top 0.61: IC1.20 169.54,207.14 169.54,202.31 174.5,197.1 181.48,197.1 182.75,198.63 184.28,198.63 192.15,190.63 202.82,190.63 218.19,175.39 217.3,172.47 217.17,171.96 218.57,170.56 218.31,169.54 218.19,169.16 222.76,164.59 222.76,160.27 229.36,153.67 229.36,143.89 231.52,141.73 231.52,130.68 234.06,128.14 234.06,124.21 234.31,123.95 LED16.K
N$17
  Top 0.61: IC2.5 167,45.09 172.59,50.67 196.34,50.67 209.68,64.01 209.68,65.41 210.69,66.42 210.69,66.68 218.31,74.3 218.31,76.33 219.96,77.98 219.96,80.39 222.88,83.31 222.88,88.39 228.98,94.49 228.98,101.22 233.68,105.92 233.68,111.27 LED17.K
N$18
  Top 0.61: IC2.6 168.27,44.83 173.1,49.66 197.1,49.66 211.07,63.63 211.07,65.28 219.58,74.04 219.71,76.07 221.36,77.72 221.36,80.26 224.28,83.19 224.28,87.76 230.63,94.11 230.63,98.59 LED18.K
N$19
  Top 0.61: IC2.7 169.54,44.7 173.48,48.64 197.74,48.64 212.47,63.37 212.47,65.15 220.73,73.66 220.85,75.69 222.63,77.47 222.63,79.88 225.55,82.8 225.55,85.29 LED19.K
N$20
  Top 0.61: IC2.8 170.81,44.58 173.86,47.62 198.37,47.62 213.87,63.12 213.87,64.9 222,73.28 222,75.18 LED20.K
N$21
  Top 0.61: IC2.9 172.08,44.58 174.24,46.74 199.01,46.74 215.65,63.37 215.65,64.05 LED21.K
N$22
  Top 0.61: IC2.10 173.35,44.45 174.75,45.85 199.9,45.85 209.55,55.5 212.62,58.55 LED22.K
N$23
  Top 0.61: IC2.11 174.62,44.2 175.39,44.96 201.39,44.96 LED23.K
N$24
  Top 0.61: IC2.12 196.61,43.02 LED24.K
N$25  (via drill 0.8 pad 1.42)
  Top 0.61: IC2.13 181.71,52.73 v182.25,52.2
  Bottom 0.61: v182.25,52.2 182.25,41.02 LED25.K
N$26  (via drill 0.8 pad 1.42)
  Top 0.61: IC2.14 174.62,54.23 175.26,54.86 v180.85,54.86 | v182.63,33.27 182.63,32.89 179.45,29.72 179.45,28.53 LED26.K
  Bottom 0.61: v180.85,54.86 180.85,35.05 v182.63,33.27
N$27  (via drill 0.8 pad 1.42)
  Top 0.61: IC2.15 173.35,54.86 174.62,56.13 178.56,56.13 v179.2,56.77
  Bottom 0.61: v179.2,56.77 179.2,41.15 177.55,39.5 175.26,39.5 171.2,35.43 171.2,29.97 167.51,26.29 167.51,23.6 LED27.K
N$28  (via drill 0.8 pad 1.42)
  Top 0.61: IC2.16 172.08,55.75 174.62,58.29 v177.55,58.29
  Bottom 0.61: v177.55,58.29 177.55,41.66 177.04,41.15 175.13,41.15 168.15,34.16 168.15,29.21 165.99,27.05 164.47,27.05 157.73,20.32 157.73,19.1 LED28.K
N$29  (via drill 0.8 pad 1.42)
  Top 0.61: v170.81,56.01 IC2.17
  Bottom 0.61: LED29.K 145.95,16.16 149.22,19.43 154.43,19.43 163.07,28.07 165.61,28.07 166.88,29.34 166.88,34.67 172.21,40 172.21,54.61 v170.81,56.01
N$30  (via drill 0.8 pad 1.42)
  Top 0.61: v169.42,57.91 169.42,53.97 169.67,53.72 169.67,52.86 IC2.18
  Bottom 0.61: LED30.K 134.37,15.12 135.76,16.51 143.26,16.51 147.57,20.83 153.16,20.83 161.67,29.34 164.47,29.34 165.35,30.23 165.35,34.92 170.05,39.62 170.05,54.48 169.42,55.12 v169.42,57.91
N$31  (via drill 0.8 pad 1.42)
  Top 0.406: 126.49,10.79 127.64,9.65 127.64,7.75 129.92,5.46 130.17,5.46 130.3,5.59 160.91,5.59 164.08,8.76 164.08,20.32 164.72,20.96 164.72,21.72
  Top 0.61: 164.72,21.72 167.39,24.38 168.27,24.38 169.42,25.53 172.97,25.53 176.15,28.7 176.15,29.97 178.69,32.51 178.69,34.54 179.7,35.56 179.7,35.94 186.82,35.94 v190.5,39.62 | v189.1,54.23 184.66,54.23 179.2,59.69 168.27,59.69 167.64,59.05 167.64,56.52 168.27,55.88 IC2.19 | 126.49,10.79 124.08,10.79 122.68,12.19 LED31.K
  Bottom 0.61: v190.5,39.62 190.5,50.8 189.1,52.2 v189.1,54.23
N$32  (via drill 0.8 pad 1.42)
  Top 0.61: v167,47.62 IC2.20
  Bottom 0.61: LED32.K 119.38,22.61 129.03,22.73 133.48,17.91 142.75,18.03 146.81,22.1 152.27,22.1 160.66,30.48 161.16,30.48 161.42,30.73 163.58,30.73 164.08,31.24 164.08,35.81 167,38.73 v167,47.62
N$33
  Top 0.61: IC3.5 73.53,44.7 74.8,45.97 84.45,45.97 85.22,45.21 85.22,38.35 86.23,37.34 102.87,37.34 104.39,35.81 104.39,21.32 LED33.K
N$34
  Top 0.61: IC3.6 74.8,44.32 75.44,44.96 83.19,44.96 83.95,44.2 83.95,24.77 84.45,24 84.45,23.44 LED34.K
N$35
  Top 0.61: IC3.7 76.07,24.88 LED35.K
N$36
  Top 0.61: IC3.8 77.34,28.07 81.92,23.5 81.92,20.83 80.65,19.56 73.15,19.56 69.22,23.5 68.45,23.5 66.42,25.53 66.42,28.53 LED36.K
N$37
  Top 0.61: IC3.9 78.61,28.45 83.19,23.88 83.19,20.7 80.52,18.03 72.9,18.03 72.14,18.8 71.88,18.8 67.82,22.86 67.69,22.86 63.5,27.05 63.5,27.81 59.31,32 58.04,32 56.77,33.27 56.77,35.05 LED37.K
N$38  (via drill 0.8 pad 1.42)
  Top 0.61: v79.88,40.13 IC3.10
  Bottom 0.61: v79.88,40.13 79.88,40 79.76,40.26 79.76,40.51 54.74,40.51 52.45,42.8 51.94,42.8 51.05,43.69 48.88,43.69 LED38.K
N$39  (via drill 0.8 pad 1.42)
  Top 0.61: IC3.11 81.15,39.37 81.03,39.24 v81.03,38.61
  Bottom 0.61: v81.03,38.61 54.74,38.61 50.67,42.67 49.66,42.67 48.89,41.91 46.35,41.91 46.1,42.16 46.1,43.18 42.54,46.74 42.54,47.62 43.69,48.77 43.69,50.16 43.31,50.55 43.31,50.67 41.91,52.07 40.88,52.07 LED39.K
N$40  (via drill 0.8 pad 1.42)
  Top 0.61: v82.42,40.77 IC3.12
  Bottom 0.61: v82.42,40.77 82.04,40.89 81.53,41.4 55.63,41.4 54.86,42.16 54.74,42.16 47.24,49.66 45.97,49.66 35.05,60.58 33.05,60.58 LED40.K
N$41
  Top 0.61: IC3.13 82.42,54.23 77.98,58.67 77.98,63.25 75.18,66.04 34.42,66.04 30.86,69.6 30.86,69.72 29.59,70.99 27.35,70.99 LED41.K
N$42
  Top 0.61: IC3.14 81.15,53.97 77.09,58.04 77.09,62.74 74.68,65.15 25.91,65.15 24.13,66.93 24.13,76.2 25.78,77.85 25.78,79.88 24.64,81.03 21.6,81.03 LED42.K
N$43
  Top 0.61: IC3.15 79.88,53.97 76.07,57.78 76.07,62.48 74.3,64.26 25.53,64.26 22.99,66.8 22.99,75.31 19.05,79.25 19.05,84.58 16.26,87.38 16.26,90.75 LED43.K
N$44
  Top 0.61: IC3.16 78.61,53.97 75.06,57.53 75.06,62.23 73.91,63.37 25.02,63.37 21.97,66.42 21.97,75.06 18.03,78.99 18.03,84.33 15.37,87 15.37,96.77 13.08,99.06 13.08,101.84 LED44.K
N$45
  Top 0.61: IC3.17 77.34,53.97 74.04,57.28 74.04,61.72 73.41,62.36 24.77,62.36 21.08,66.04 21.08,74.68 17.02,78.74 17.02,84.07 14.48,86.61 14.48,96.14 12.19,98.43 12.19,110.36 11.56,111 11.56,113.54 LED45.K
N$46
  Top 0.61: IC3.18 76.07,53.85 73.15,56.77 73.15,61.21 72.9,61.47 41.4,61.47 36.7,56.77 24.64,56.77 17.91,63.5 17.91,76.45 16,78.36 16,83.69 13.59,86.11 13.59,95.5 11.3,97.79 11.3,109.98 10.03,111.25 10.03,124.21 LED46.K
N$47
  Top 0.61: IC3.19 74.8,53.85 72.26,56.39 72.26,60.2 71.88,60.58 41.91,60.58 37.08,55.75 24.13,55.75 16.89,63.12 16.89,76.07 15.11,77.85 15.11,83.31 12.7,85.73 12.7,95 10.41,97.28 10.41,109.6 9.14,110.87 9.14,125.98 14.22,131.06 14.22,137.03 LED47.K
N$48
  Top 0.61: IC3.20 73.53,53.85 71.76,55.63 71.63,55.63 71.25,56.01 71.25,59.31 70.87,59.69 42.29,59.69 37.34,54.74 23.88,54.74 15.88,62.74 15.88,75.57 14.1,77.34 14.1,82.68 11.56,85.22 11.56,94.36 9.4,96.52 9.4,109.22 8.13,110.49 8.13,137.03 11.81,140.72 13.84,140.72 15.11,141.99 15.11,144.65 16.38,145.92 16.38,148.19 LED48.K
N$49  (via drill 0.8 pad 1.42)
  Top 0.61: IC4.5 77.47,212.34 v70.99,208.66 | v61.34,202.06 59.44,204.72 55.5,204.72 50.42,199.64 48.26,199.64 31.12,182.5 31.12,181.1 24.26,174.24 24.26,170.56 18.17,164.48 LED49.K
  Bottom 0.61: v61.34,202.06 v70.99,208.66
N$50
  Top 0.61: IC4.6 77.47,209.8 78.61,207.77 78.61,203.58 73.41,198.37 67.31,198.37 59.82,205.87 54.99,205.87 49.78,200.66 47.75,200.66 30.1,183.01 30.1,181.48 22.36,173.74 LED50.K
N$51
  Top 0.61: IC4.7 77.6,207.01 77.6,203.83 73.03,199.26 67.82,199.26 60.2,206.88 54.61,206.88 49.4,201.68 47.29,201.68 LED51.K
N$52
  Top 0.61: IC4.8 76.45,206.5 76.45,204.09 72.52,200.15 68.2,200.15 60.58,207.77 53.97,207.77 48.77,202.56 45.85,202.56 37.21,193.93 35.81,193.93 34.53,192.64 LED52.K
N$53
  Top 0.61: IC4.9 75.18,205.99 75.18,204.22 72.14,201.17 68.58,201.17 60.96,208.79 53.34,208.79 48.26,203.71 44.61,203.71 LED53.K
N$54
  Top 0.61: IC4.10 74.17,205.49 74.17,204.72 71.63,202.18 69.09,202.18 60.96,210.31 52.07,210.31 50.89,209.13 LED54.K
N$55
  Top 0.61: IC4.11 72.9,204.98 71.37,203.45 69.6,203.45 59.44,213.61 59.44,216.38 LED55.K
N$56
  Top 0.61: IC4.12 62.48,219.96 66.29,223.77 68.03,223.77 LED56.K
N$57  (via drill 0.8 pad 1.42)
  Top 0.61: IC4.13 75.32,197.48 65.53,197.48 62.86,200.15 60.45,200.15 58.55,202.06 v58.55,203.07 | v69.72,210.95 66.93,215.65 66.93,216.15 68.96,218.19 71.5,218.19 77.6,224.28 77.85,224.28 79.76,226.19 79.76,227.74 LED57.K
  Bottom 0.61: v58.55,203.07 v69.72,210.95
N$58  (via drill 0.8 pad 1.42)
  Top 0.61: IC4.14 75.95,199.64 79.63,203.33 v79.63,208.66 | v79.63,217.68 79.76,223.52 84.96,228.73 89.41,228.73 90.81,230.12 90.81,231.6 LED58.K
  Bottom 0.61: v79.63,208.66 v79.63,217.68
N$59  (via drill 0.8 pad 1.42)
  Top 0.61: IC4.15 78.61,197.74 78.61,196.85 77.47,195.71 75.18,195.71 74.3,196.6 64.39,196.6 61.85,199.14 60.07,199.14 56.64,202.56 v56.64,203.45
  Bottom 0.61: v56.64,203.45 66.04,212.85 73.03,212.85 75.57,215.39 86.11,227.2 91.19,227.2 96.27,232.28 101.6,232.28 101.83,232.51 LED59.K
N$60
  Top 0.61: IC4.16 81.28,196.34 87.12,196.34 107.7,217.3 113.41,223.01 113.41,236.22 LED60.K
N$62  (via drill 0.8 pad 1.42)
  Top 0.61: LED65.K 221.78,64.43 220.6,64.39 215.26,59.05 215.26,58.29 214.38,57.4 213.74,57.4 211.33,54.99 211.2,54.99 210.44,54.23 209.8,54.23 209.3,53.72 209.3,53.09 209.42,50.42 199.39,40.26 193.55,40.26 191.9,41.4 189.23,41.4 187.45,39.12 165.99,39.12 165.1,38.23 158.11,38.23 155.83,40.51 148.72,40.51 148.34,40.89 144.02,40.89 143.13,40.13 143.13,34.92 v134.24,26.04 | v112.27,26.04 109.98,28.32 109.98,39.37 111.38,40.77 IC5.5
  Bottom 0.61: v134.24,26.04 v112.27,26.04
N$63  (via drill 0.8 pad 1.42)
  Top 0.61: IC1.22 167,207.77 v165.99,207.77 | v167.51,91.57 171.7,91.57 174.12,89.15 174.12,85.34 171.07,82.3 171.07,73.28 167.51,69.72 167.51,67.95 v168.02,67.44 | v163.19,46.1 IC2.2
  Bottom 0.61: v165.99,207.77 165.99,200.53 171.07,195.45 171.07,192.66 163.32,184.91 161.16,184.91 159.64,183.39 159.64,178.82 165.86,172.59 165.86,158.37 158.88,151.38 158.88,134.87 161.42,132.33 161.54,132.33 162.81,131.06 162.69,113.92 159.51,110.62 159.51,90.93 160.66,89.79 165.73,89.79 v167.51,91.57 | v168.02,67.44 168.02,62.99 167.77,62.74 167.77,62.61 166.62,61.47 166.62,59.69 167,59.31 167,53.97 165.35,52.32 164.47,52.32 162.94,50.8 162.94,46.35 v163.19,46.1
N$64  (via drill 0.8 pad 1.42)
  Top 0.61: IC3.2 v69.72,46.35 | v88.01,47.24 86.49,44.7 86.49,38.48 104.14,38.48 105.54,37.08 105.54,24.77 106.93,23.37 109.22,23.37 109.47,23.11 v114.81,23.11 | v164.59,49.66 164.59,51.05 164.47,51.18 IC2.22
  Bottom 0.61: v69.72,46.35 70.61,47.24 v88.01,47.24 | v114.81,23.11 116.46,24.89 131.32,24.89 137.03,19.18 141.86,19.18 146.18,23.5 151.89,23.5 151.89,24 159.64,31.75 161.92,31.75 162.81,32.64 162.81,36.32 165.61,39.12 165.61,48.64 v164.59,49.66
N$65  (via drill 0.8 pad 1.42)
  Top 0.61: IC4.2 82.68,210.95 v83.69,210.95 | v101.35,187.2 101.35,186.94 107.57,180.72 107.57,177.93 104.39,174.75 104.39,168.91 98.93,163.7 98.93,148.21 97.03,146.3 97.03,132.97 99.82,130.17 99.82,126.75 103.63,122.68 103.63,106.43 107.57,102.62 107.57,85.73 104.52,82.68 101.6,82.68 95.76,76.84 95.76,72.26 93.22,69.72 93.22,59.05 v84.07,49.91 | IC3.22 70.99,50.8 70.1,49.91 v69.6,49.91
  Bottom 0.61: v83.69,210.95 85.22,210.95 90.68,205.49 99.31,205.49 103.25,201.55 103.25,198.37 106.3,195.33 106.3,194.56 104.27,192.53 104.27,190.12 v101.35,187.2 | v84.07,49.91 v69.6,49.91
N$66
  Top 0.406: 126.11,9.65 126.75,9.02 126.75,7.37 129.41,4.7 162.05,4.7 165.1,7.75 165.1,17.02 166.18,18.1 166.18,18.23
  Top 0.61: LED66.K 182.75,21.21 182.63,21.08 182.63,22.23 180.59,24.26 176.66,24.26 173.48,21.08 169.04,21.08 166.18,18.23 165.86,17.91 | 126.11,9.65 121.16,9.65 119.25,11.56 119.25,25.4 116.46,28.19 116.33,28.19 113.54,30.99 113.54,37.34 115.82,39.62 118.46,39.62 IC5.6
N$67  (via drill 0.8 pad 1.42)
  Top 0.61: LED67.K 122.68,5.97 117.48,11.18 117.48,25.02 112.27,30.23 112.27,37.46 v111.51,38.23 | v116.33,38.23 IC5.7
  Bottom 0.61: v111.51,38.23 v116.33,38.23
N$68  (via drill 0.8 pad 1.42)
  Top 0.61: IC5.8 115.82,36.96 v115.19,36.32 | v108.59,36.32 108.59,27.43 111.76,24.26 113.28,24.26 113.92,24.89 115.82,24.89 116.46,24.26 116.46,22.1 111.25,16.89 105.66,16.89 104.52,15.75 104.52,15.11 102.87,13.46 99.06,13.46 97.66,14.86 97.66,16.64 103.12,22.1 103.12,34.8 101.73,36.2 87.38,36.2 85.09,33.66 85.09,25.27 89.66,20.7 89.66,19.69 89.15,18.29 88.9,18.03 86.87,18.03 86.74,18.16 82.3,18.16 81.03,16.89 71.63,16.89 65.41,23.11 63.92,23.11 LED68.K
  Bottom 0.61: v108.59,36.32 v115.19,36.32
N$69  (via drill 0.8 pad 1.42)
  Top 0.61: LED69.K 19.69,66.42 19.18,65.91 19.18,63.75 25.02,57.91 32.13,57.91 34.04,59.82 37.08,59.82 v38.1,60.83 | v119.13,27.56 114.94,31.75 114.94,33.78 116.97,35.69 IC5.9
  Bottom 0.61: v38.1,60.83 38.1,59.05 46.35,50.8 47.5,50.8 48.89,49.4 49.02,49.4 56.13,42.29 81.41,42.29 81.92,42.8 83.95,42.8 86.49,40.26 86.49,23.88 88.01,22.35 96.65,22.35 99.7,19.3 108.97,19.3 110.36,20.7 110.36,26.42 111.51,27.56 v119.13,27.56
N$70  (via drill 0.8 pad 1.42)
  Top 0.61: LED70.K 5.71,126.49 6.98,125.22 6.98,109.86 8.38,108.46 8.38,96.01 10.54,93.85 10.54,84.96 13.21,82.3 13.21,76.58 14.86,74.93 14.86,61.72 22.73,53.85 37.97,53.85 42.8,58.67 68.2,58.67 68.45,58.42 v69.47,58.42 | v89.92,47.12 95.89,40.77 107.7,40.77 v108.46,40 | v121.29,34.42 IC5.10
  Bottom 0.61: v69.47,58.42 69.98,58.8 78.99,58.8 80.52,57.28 83.69,57.28 85.22,55.75 85.22,53.85 88.27,51.31 89.66,50.16 89.66,47.37 v89.92,47.12 | v108.46,40 106.81,38.35 106.81,33.27 107.32,32.77 110.74,32.77 112.4,34.42 v121.29,34.42
N$71  (via drill 0.8 pad 1.42)
  Top 0.61: LED71.K 20.96,183.51 22.61,181.86 22.61,176.28 21.21,174.88 21.21,172.97 20.57,172.34 20.57,170.81 19.43,169.67 19.43,168.15 16.51,165.23 16.51,160.4 15.11,159 15.11,157.35 17.53,154.94 17.53,145.29 16.38,144.14 16.38,139.45 15.49,138.56 15.49,130.05 13.97,128.52 13.97,122.81 14.73,122.05 14.73,106.68 16.13,105.28 16.26,105.28 16.64,104.9 16.64,96.9 19.56,93.98 19.56,89.15 20.07,88.65 20.07,84.2 21.97,82.3 24.77,82.3 26.8,80.26 26.8,77.09 25.4,75.69 25.4,68.83 27.69,66.55 v30.86,66.55 | v116.33,33.15 IC5.11 | v88.14,43.81 89.66,39.62 106.05,39.62 106.81,38.86 106.81,27.18 106.93,27.05 v106.93,25.65
  Bottom 0.61: v30.86,66.55 34.92,62.48 38.48,62.48 39.88,61.09 39.88,59.44 47.24,52.07 48.26,52.07 57.02,43.31 80.52,43.31 80.9,43.69 86.11,43.69 86.61,43.18 v88.14,43.81 | v106.93,25.65 106.93,28.45 113.67,33.15 v116.33,33.15
N$72  (via drill 0.8 pad 1.42)
  Top 0.61: LED72.K 65.23,225.25 60.71,220.73 60.71,214.5 v69.34,205.87 | IC5.12 118.59,30.38 v121.41,27.56 | 98.93,174.24 v99.06,174.24 100.58,175.77 v100.58,181.36